# EasyEDA Pro project ProPrj_嵌赛国赛_2025-08-15.epro, board PCB3
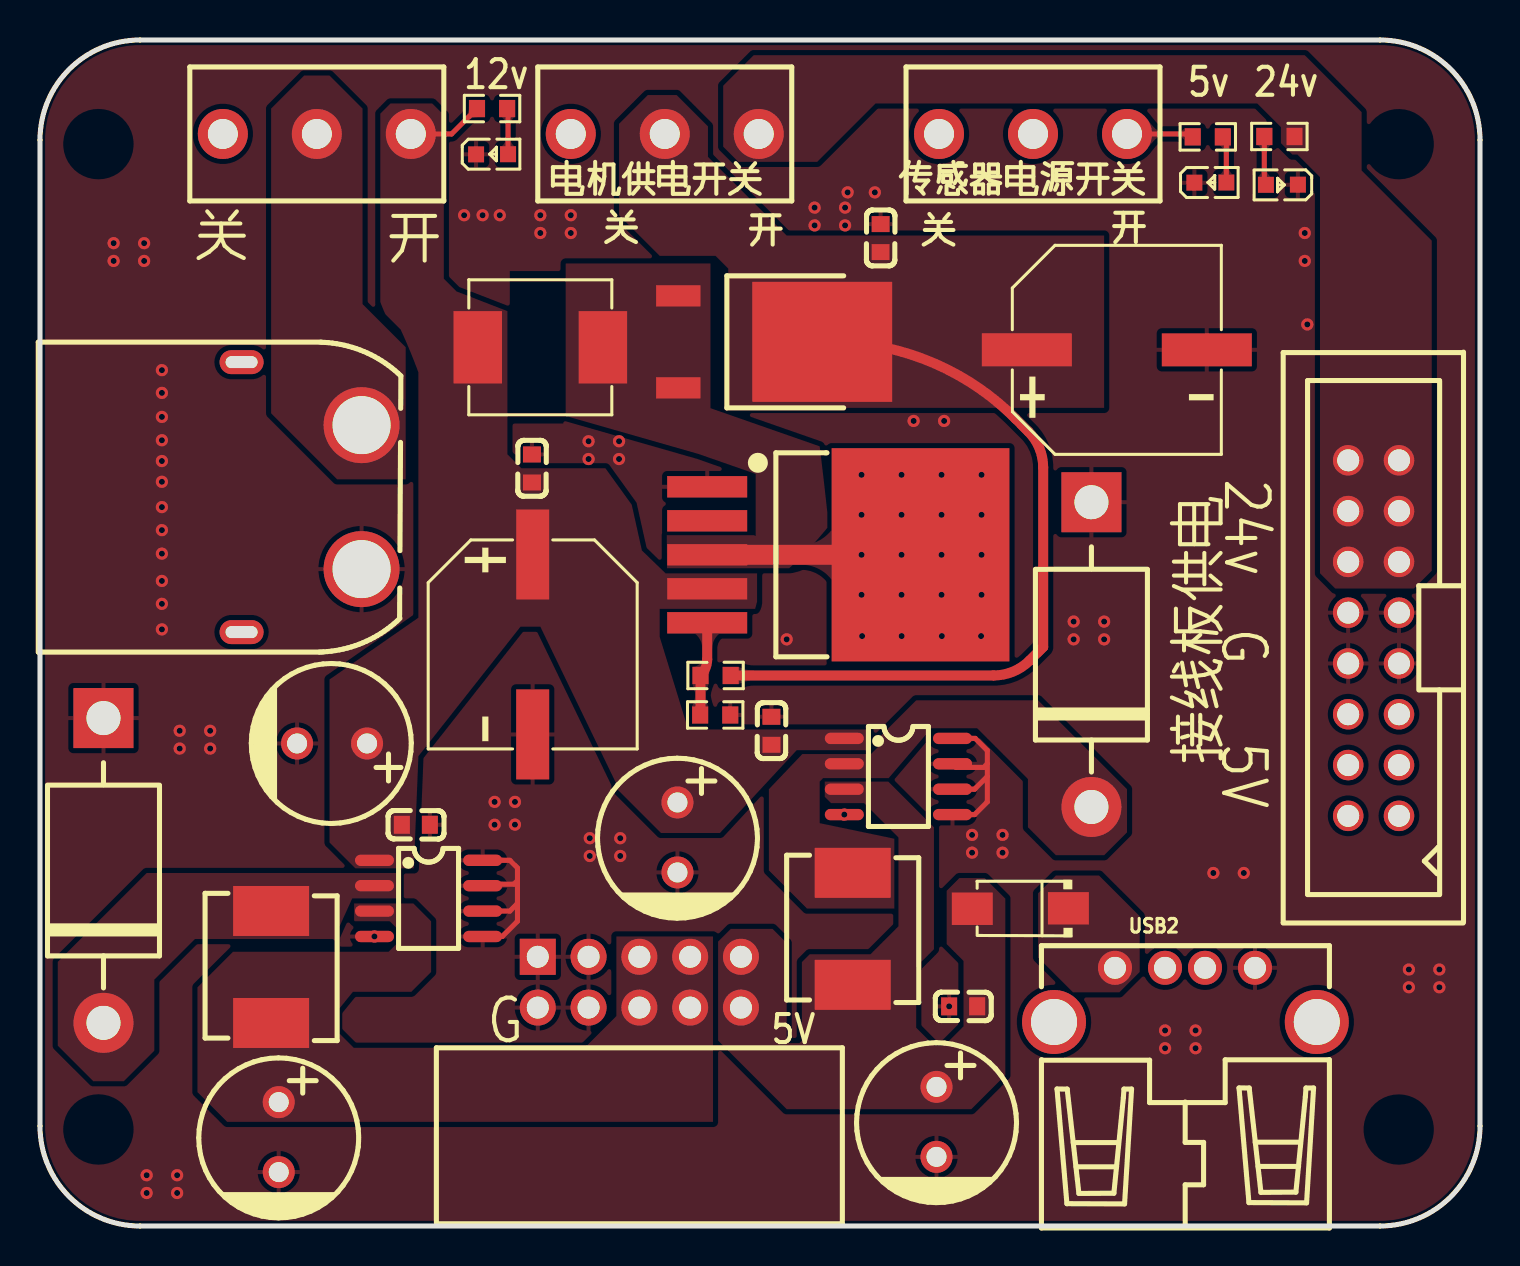
[diagram p22: board, top side]
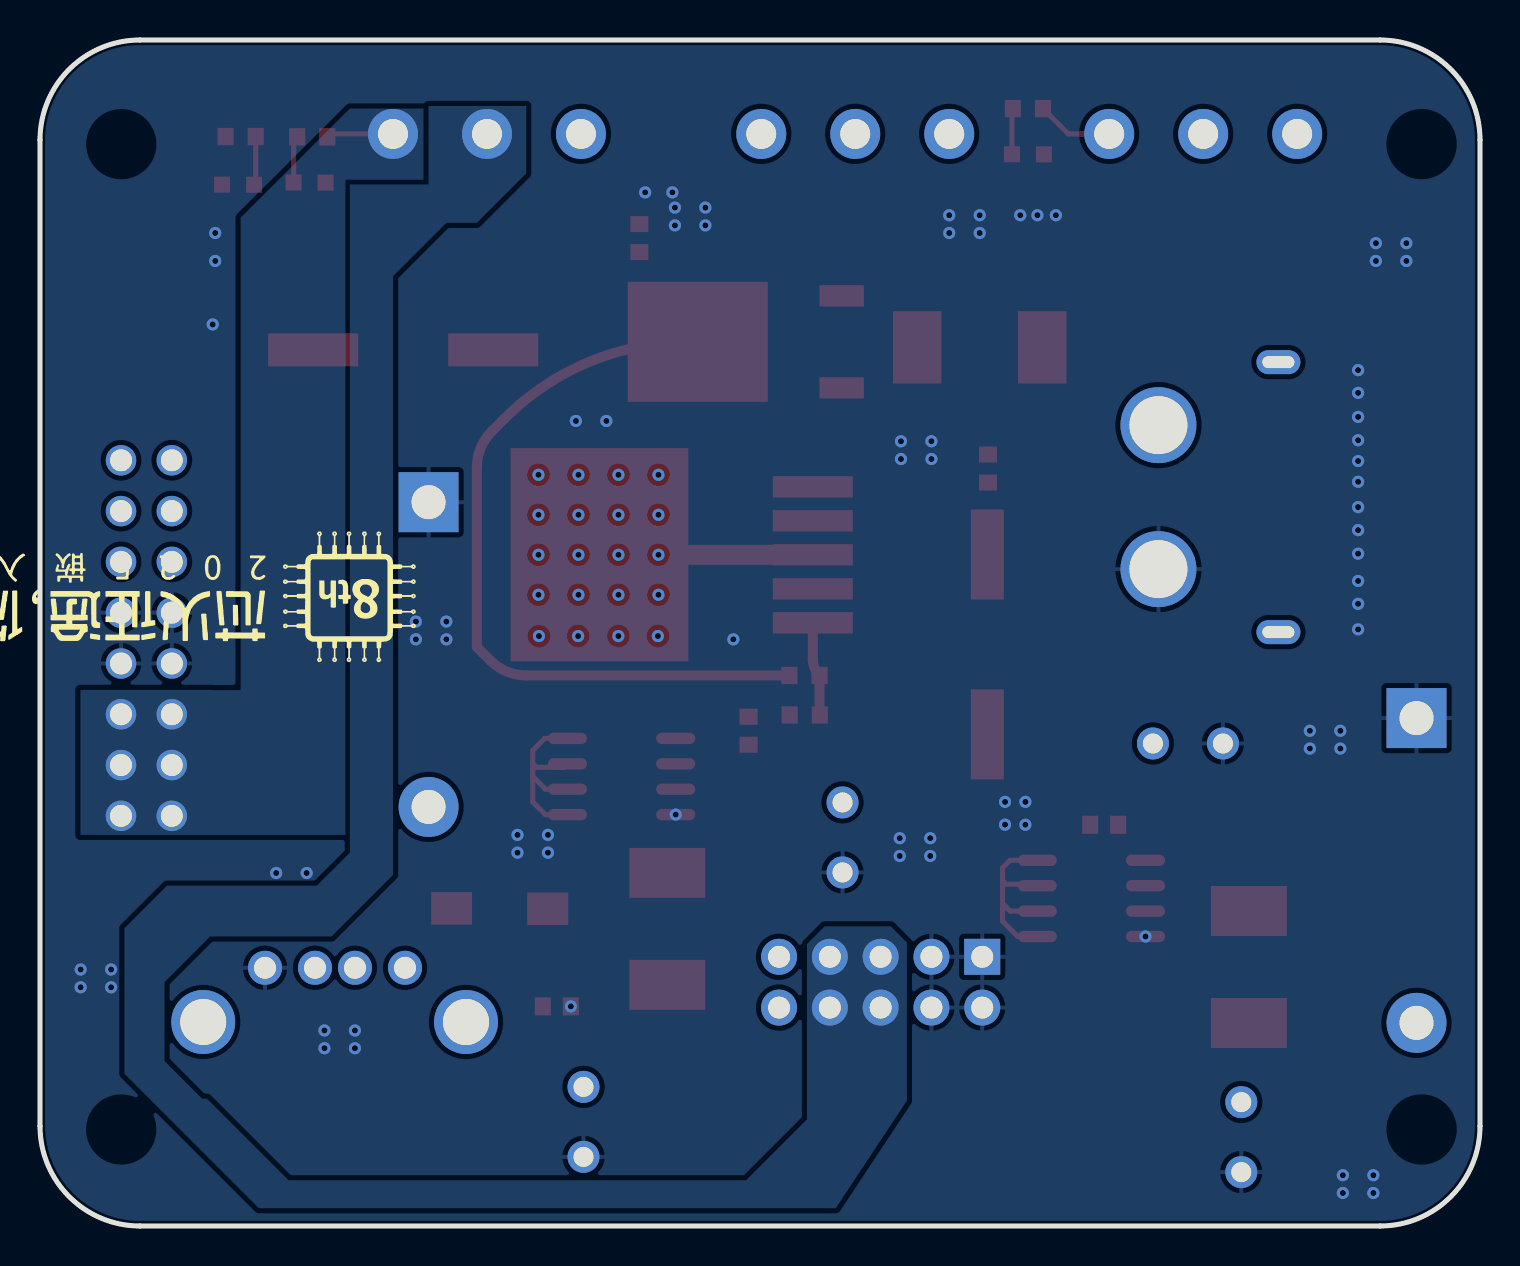
[diagram p23: board, bottom side, seen from below]

Outline 72.01 x 59.31 mm; copper layers: Top Layer, Bottom Layer. Coordinates in mm from the lower left corner of the outline.
Outline path: 0,54.31 0,5 arc(1.46,1.46) 5,0 67.01,0 arc(70.54,1.46) 72.01,5 72.01,54.31 arc(70.54,57.84) 67.01,59.31 5,59.31 arc(1.46,57.84) 0,54.31
Stack: Top Layer 0.035mm / Dielectric1 1.51mm FR4 er 4.5 / Bottom Layer 0.035mm

## Design rules (mm)
template: 自定义配置
spacing copperThickness1oz (default): track to track 0.102, other pairs 0.152 to 0.3
spacing copperThickness2oz: track to track 0.203, other pairs 0.152 to 0.3
track width copperThickness1oz (default): min 0.127, default 0.254, max 2.54
track width copperThickness2oz: min 0.203, default 0.254, max 2.54
differential pair differentialPair (default): width min 0.127, default 0.254, max 2.54; gap min 0.152, default 0.152
via viaSize (default): diameter min 0.5, default 0.61, max 10; hole min 0.3, default 0.305, max 6.3
net 12V uses 12321321
net 5V2A uses 12321321
net $1N866 uses 12321321
net $1N885 uses 12321321
net 5V2A_OUT uses 12321321
net 24V_OUT uses 12321321
net 24V uses 12321321
net $1N2663 uses 12321321
net $1N3998 uses 12321321

## Placement (name value [footprint] x y rotation side)
C1  680uF  [CAP-SMD_BD10.0-L10.3-W10.3-LS11.3-FD]  24.64 29.08 270 top
C3  1uF  [C0603]  24.6 37.88 270 top
C5  1uF  [C0603]  42.04 49.4 270 top
C7  1uF  [C0603]  18.8 20.07 180 top
C8  180uF  [CAP-TH_BD8.0-P3.50-D0.6-FD]  11.94 4.45 270 top
C9  470uF  [CAP-TH_BD8.0-P3.50-D0.6-FD_1]  14.6 24.13 180 top
C10  680uF  [CAP-SMD_BD10.0-L10.3-W10.3-LS11.3-FD]  53.85 43.82 0 top
C11  1uF  [C0603]  36.58 24.77 270 top
C12  180uF  [CAP-TH_BD8.0-P3.50-D0.6-FD]  44.83 5.21 270 top
C13  470uF  [CAP-TH_BD8.0-P3.50-D0.6-FD_1]  31.88 19.43 270 top
C69  100nF  [C0603]  46.16 10.98 180 top
CN1  XT60PW-M  [CONN-TH_XT60PW-M]  13.08 36.45 0 top
D1  MBRD1045  [TO-252-3_L6.5-W5.9-P4.60-LS10.0-BL]  35.52 44.21 270 top
D2  SS56  [SMA_L4.3-W2.6-LS5.0-RD]  49.02 15.88 180 top
L1  47uH  [IND-SMD_L7.0-W6.6_FXL0630]  25.02 43.94 180 top
L2  68uH  [IND-SMD_L7.1-W6.6-1]  11.56 12.95 90 top
L3  68uH  [IND-SMD_L7.1-W6.6-1]  40.64 14.86 90 top
LED1  XL-1608SURC-06  [LED0603-RD_RED]  22.61 53.59 0 top
LED3  XL-1608SURC-06  [LED0603-RD_RED]  58.52 52.18 0 top
LED4  XL-1608SURC-06  [LED0603-RD_RED]  62.1 52.07 180 top
P1  2.54-2*8P简牛  [IDC-TH_16P-P2.54_C3406]  66.69 29.4 90 top
R1  49.9kΩ  [R0603]  33.78 27.53 0 top
R2  2.7kΩ  [R0603]  33.76 25.56 180 top
R5  10kΩ  [R0603]  58.4 54.46 0 top
R49  10kΩ  [R0603]  22.61 55.88 0 top
R50  10kΩ  [R0603]  61.98 54.48 180 top
U1  XL6019E1  [TO-263-5_L10.2-W9.9-P1.70-LS14.4-TL]  38.7 33.57 0 top
U3  XL1509-5.0E1  [SOIC-8_L5.0-W4.0-P1.27-LS6.0-BL]  19.43 16.38 270 top
U4  1N5820-E3/54  [DO-201AD_BD5.3-L8.4-P12.50-D1.4-FD]  3.17 17.78 270 top
U5  HC-JN254-2-05-W  [HDR-TH_10P-P2.54-H-F-R2-C5-W9.0]  29.97 12.19 0 top
U38  -  [电源开关]  13.84 54.61 180 top
U39  -  [电源开关]  49.66 54.61 180 top
U40  -  [电源开关]  31.24 54.61 180 top
U41  XL1509-5.0E1  [SOIC-8_L5.0-W4.0-P1.27-LS6.0-BL]  42.93 22.48 270 top
U42  1N5820-E3/54  [DO-201AD_BD5.3-L8.4-P12.50-D1.4-FD]  52.58 28.58 270 top
USB2  AF 90° WJDG  [USB-A-TH_AF-WJDG]  57.28 11.56 0 top

## Footprints (pads in the part's own frame, mm; a bottom-side part is the same pattern mirrored in y, then rotated)
C0603
  rect 0.8x0.9 smd: 1(-0.7,0) 2(0.7,0)
CAP-SMD_BD10.0-L10.3-W10.3-LS11.3-FD
  rect 4.5x1.65 smd: 1(-4.5,0) 2(4.5,0)
CAP-TH_BD8.0-P3.50-D0.6-FD
  round 1.6 hole 1: 1(-1.75,0) 2(1.75,0)
CAP-TH_BD8.0-P3.50-D0.6-FD_1
  round 1.6 hole 1: 1(-1.75,0) 2(1.75,0)
CONN-TH_XT60PW-M
  round 3.8 hole 2.9: 1(3,-3.6) 2(3,3.6)
  oval 2.2x1.2 hole 1.6x0.6: 3(-3,6.75) 4(-3,-6.75)
DO-201AD_BD5.3-L8.4-P12.50-D1.4-FD
  rect 3x3 hole 1.7: 1(-7.62,0)
  round 3 hole 1.7: 2(7.62,0)
HDR-TH_10P-P2.54-H-F-R2-C5-W9.0
  rect 1.8x1.8 hole 1.1: 1(-5.08,1.27)
  round 1.8 hole 1.1: 2(-5.08,-1.27) 3(-2.54,1.27) 4(-2.54,-1.27) 5(0,1.27) 6(0,-1.27) 7(2.54,1.27) 8(2.54,-1.27) 9(5.08,1.27) 10(5.08,-1.27)
IDC-TH_16P-P2.54_C3406
  round 1.524 hole 1.1: 1(-8.89,-1.27) 2(-8.89,1.27) 3(-6.35,-1.27) 4(-6.35,1.27) 5(-3.81,-1.27) 6(-3.81,1.27) 7(-1.27,-1.27) 8(-1.27,1.27) 9(1.27,-1.27) 10(1.27,1.27) 11(3.81,-1.27) 12(3.81,1.27) 13(6.35,-1.27) 14(6.35,1.27) 15(8.89,-1.27) 16(8.89,1.27)
IND-SMD_L7.0-W6.6_FXL0630
  rect 2.424x3.62 smd: 1(3.128,0) 2(-3.128,0)
IND-SMD_L7.1-W6.6-1
  rect 2.5x3.8 smd: 1(-2.8,0) 2(2.8,0)
LED0603-RD_RED
  rect 0.8x0.8 smd: 1(-0.799,-0.004) 2(0.799,0.004)
R0603
  rect 0.806x0.864 smd: 1(-0.753,0) 2(0.753,0)
SMA_L4.3-W2.6-LS5.0-RD
  rect 2.046x1.62 smd: 1(-2.404,-0.009) 2(2.404,0.009)
SOIC-8_L5.0-W4.0-P1.27-LS6.0-BL
  oval 0.569x1.95 smd: 1(-1.905,-2.705) 2(-0.635,-2.705) 3(0.635,-2.705) 4(1.905,-2.705) 5(1.905,2.705) 6(0.635,2.705) 7(-0.635,2.705) 8(-1.905,2.705)
TO-252-3_L6.5-W5.9-P4.60-LS10.0-BL
  rect 1.064x2.219 smd: 1(-2.3,-3.599) 3(2.3,-3.599)
  rect 6x7 smd: 2(0,3.599)
TO-263-5_L10.2-W9.9-P1.70-LS14.4-TL
  rect 4x1.069 smd: 1(-5.334,3.4) 2(-5.334,1.7) 3(-5.334,0) 4(-5.334,-1.7) 5(-5.334,-3.4)
  rect 8.89x10.66 smd: 6(5.334,0)
USB-A-TH_AF-WJDG
  round 1.7 hole 1.1: 1(-3.521,1.355) 2(-1.018,1.355) 3(0.981,1.355) 4(3.48,1.355)
  round 3.2 hole 2.3: 5(-6.57,-1.355) 5(6.57,-1.355)
电源开关
  round 2.5 hole 1.5: 1(-4.7,0) 2(0,0) 3(4.7,0)

## Nets
As in the schematic.

Pads without a net: CN1 3 4; U1 2; U38 3; U39 3; U40 3; USB2 2 3 5

## Via types
v1: diameter 0.61, hole 0.305, Top Layer to Bottom Layer, 96 vias

## Routing (per net, layer and track width the routed paths; a pad name or vN(x,y) marks a point on that pad's centre or on a via; arc(x,y) is an arc through that point)
5V2A_OUT: length 3.3
  Top Layer w0.254: U39.1 57.5,54.61 R5.1
12V: length 3.8
  Top Layer w0.254: R49.1 20.58,54.61 U38.1
24V: length 38.7
  Top Layer w0.5: R1.2 47.69,27.53 arc(48.66,27.72) 49.48,28.27 50.17,28.96 50.17,37.94 arc(49.97,38.91) 49.42,39.73 48.77,40.38 arc(44.53,43.22) 39.52,44.21 39.12,44.21
GND: length 20.8
  Top Layer w0.254: U3.7 22.21,17.09 23.7,17.09 23.88,17.27 ; 47.37,22.48 46.74,21.84 45.63,21.84 ; 47.37,22.48 47.37,23.11 ; 47.37,22.48 47.37,21.21 46.74,20.57 45.63,20.57 ; 23.88,16.13 23.49,15.75 U3.6 ; 23.88,16.13 23.88,17.27 ; 23.88,16.13 23.88,15.24 23.11,14.48 U3.5 ; 23.88,17.27 23.88,17.91 23.49,18.29 U3.8 ; 45.63,24.38 46.77,24.38 47.37,23.78 47.37,23.11 ; 47.37,23.11 47.19,22.93 45.81,22.93 45.63,23.11
  vias: v1(3.68,49.15) v1(3.68,48.26) v1(5.21,49.15) v1(5.21,48.26) v1(5.33,2.54) v1(5.33,1.65) v1(6.1,42.8) v1(6.1,41.66) v1(6.1,40.46) v1(6.1,39.29) v1(6.1,38.25) v1(6.1,37.22) v1(6.1,35.95) v1(6.1,34.8) v1(6.1,33.62) v1(6.1,32.26) v1(6.1,31.11) v1(6.1,29.84) v1(6.86,2.54) v1(6.86,1.65) v1(6.98,24.77) v1(6.98,23.88) v1(8.51,24.77) v1(8.51,23.88) v1(16.73,14.48) v1(21.21,50.55) v1(22.13,50.55) v1(22.73,21.21) v1(22.73,20.07) v1(22.99,50.55) v1(23.75,21.21) v1(23.75,20.07) v1(25.02,50.55) v1(25.02,49.66) v1(26.54,50.55) v1(26.54,49.66) v1(27.43,39.24) v1(27.43,38.35) v1(27.49,19.39) v1(27.49,18.5) v1(28.96,39.24) v1(28.96,38.35) v1(29.02,19.39) v1(29.02,18.5) v1(37.34,29.34) v1(38.73,50.93) v1(38.73,50.04) v1(40.26,50.93) v1(40.26,50.04) v1(40.22,20.57) v1(40.39,51.69) v1(41.75,51.69) v1(43.69,40.26) v1(45.21,40.26) v1(45.46,10.98) v1(46.61,19.56) v1(46.61,18.67) v1(48.13,19.56) v1(48.13,18.67) v1(51.69,30.23) v1(51.69,29.34) v1(53.21,30.23) v1(53.21,29.34) v1(56.26,9.78) v1(56.26,8.89) v1(57.78,9.78) v1(57.78,8.89) v1(58.67,17.65) v1(60.2,17.65) v1(63.25,49.66) v1(63.25,48.26) v1(63.37,45.09) v1(68.45,12.83) v1(68.45,11.94) v1(69.98,12.83) v1(69.98,11.94)
$1N873: length 2.3
  Top Layer w0.254: LED1.2 23.41,55.83 R49.2
$1N876: length 2.4
  Top Layer w0.254: R5.2 59.32,54.29 LED3.2
$1N2658: length 4.7
  Top Layer w0.5: U1.5 33.36,28.34 arc(33.28,27.9) R1.1 33.03,25.6 arc(33.02,25.58) 33.01,25.56
$1N2663: length 7.7
  Top Layer w1: U1.3 v1(41.08,33.57)
  vias: v1(41.08,37.57) v1(41.08,35.57) v1(41.08,31.57) v1(41.11,29.5) v1(43.08,37.57) v1(43.08,35.57) v1(43.08,33.57) v1(43.08,31.57) v1(43.09,29.5) v1(45.08,37.57) v1(45.08,35.57) v1(45.08,33.57) v1(45.08,31.57) v1(45.1,29.5) v1(47.08,37.57) v1(47.08,35.57) v1(47.08,33.57) v1(47.08,31.57) v1(47.06,29.5)
$1N2780: length 2.5
  Top Layer w0.254: R50.2 61.22,52.15 LED4.2

## Copper pours and planes (outline as drawn; the poured copper is in the pictures)
5V2A on Top Layer: 7.87,16.13 33.65,16.13 33.65,5.21 7.87,5.21
5V2A on Bottom Layer: 28.66,56.01 67.79,56.01 67.79,0.89 28.66,0.89
5V2A_OUT on Bottom Layer: 52.83,55.88 69.99,55.88 69.99,19.56 52.83,19.56
5V2AESP32 on Top Layer: 33.91,22.23 48.27,22.23 48.27,5.84 33.91,5.84
12V on Top Layer: 14.48,56.13 41.43,56.13 41.43,17.89 14.48,17.89
24V on Top Layer: 28.96,56.56 53.21,56.56 53.21,40.91 28.96,40.91
24V_OUT on Top Layer: 34.16,58.55 69.6,58.55 69.6,31.88 34.16,31.88
GND on Top Layer: -13.46,68.07 102.36,68.07 111.76,58.67 111.76,-7.24 96.52,-22.48 -2.41,-22.48 -13.46,-11.43
GND on Bottom Layer: -24.38,65.53 110.74,65.53 110.74,-13.33 99.06,-25.02 -39.37,-25.02 -52.58,-11.81 -52.58,37.34
$1N866 on Top Layer: 11.56,57.53 18.29,57.53 18.29,37.34 11.56,37.34
$1N885 on Top Layer: 0.89,17.65 17.93,17.65 17.93,7.24 0.89,7.24
$1N2663 on Top Layer: 26.29,48.13 39.37,48.13 39.37,32.89 26.29,32.89
$1N3998 on Top Layer: 36.45,26.29 54.36,26.29 54.36,15.88 36.45,15.88
$2N230 on Top Layer: 49.91,17.53 54.99,17.53 54.99,11.68 49.91,11.68

Small or netless copper shapes (teardrops, artwork), in the pictures only: 30 on Top Layer

## Text on the board
Top Silkscreen Layer: 12v | 5V | 5v | 24v | G | 电机供电开关 | 关 | 开 | 传感器电源开关 | 接线板供电
